# Altium schematic sheet LiPoBattery.SchDoc
size A4; SheetNumber: 1; SheetTotal: 1
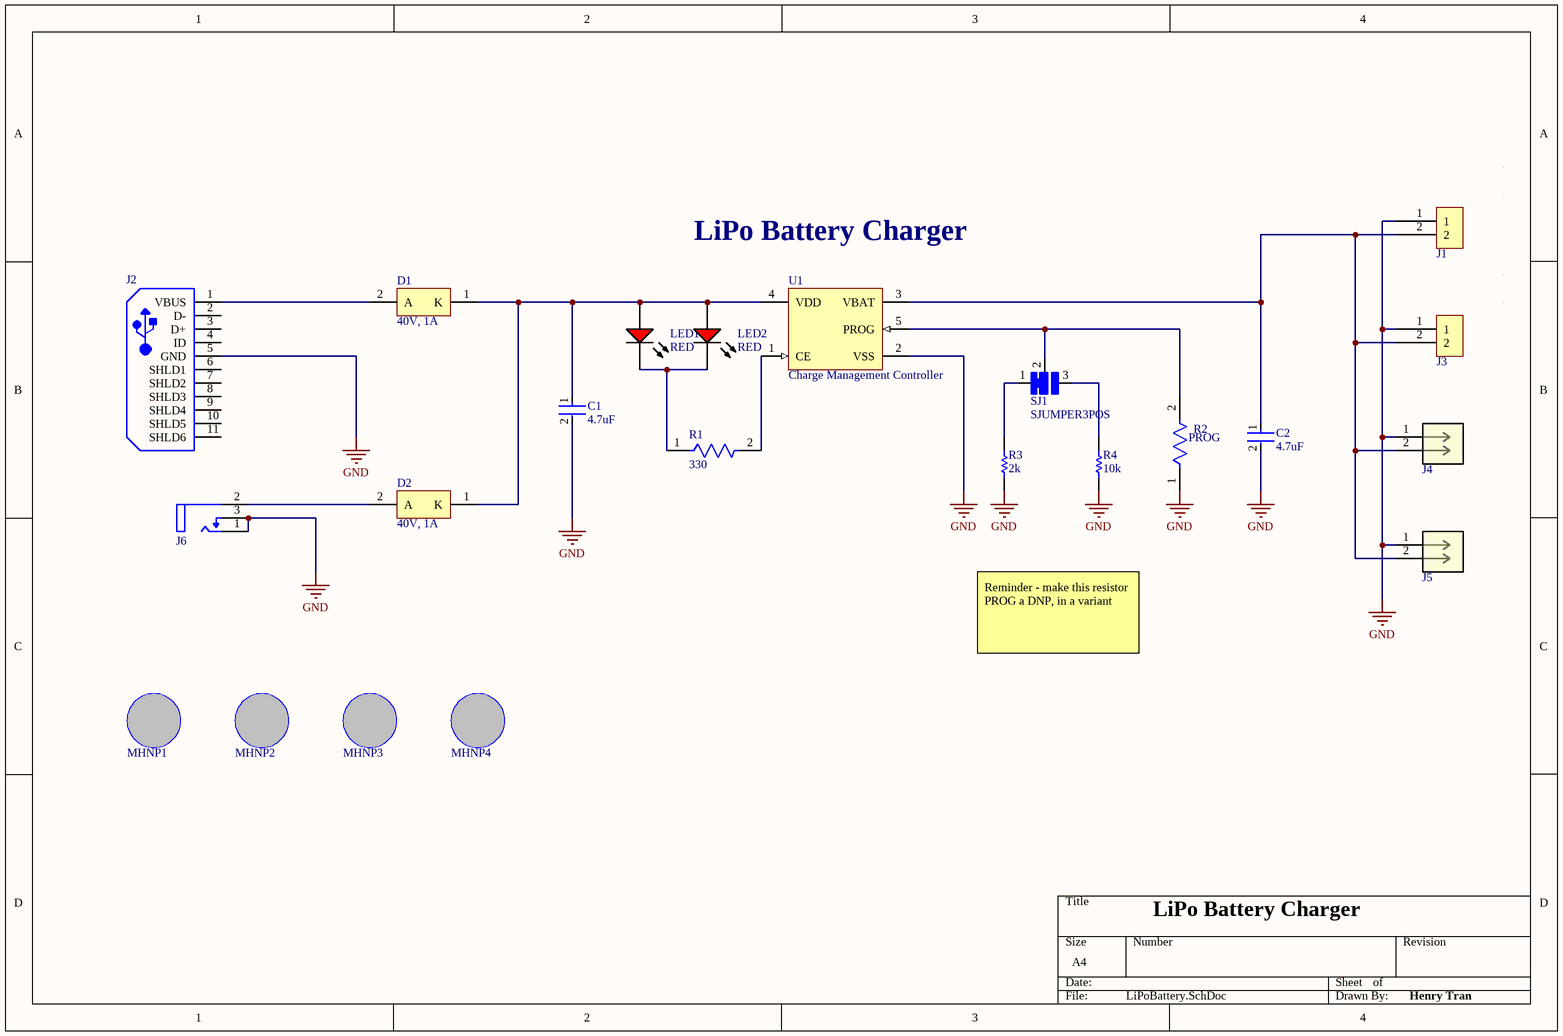
[diagram p0: LiPoBattery.SchDoc]

## Parts
C1  4.7uF  [FP-CC0805-0_85-MFG]
C2  4.7uF  [FP-CC0805-0_85-MFG]
D1  40V, 1A  [ONSC-SMA-2-403D-02_V]
D2  40V, 1A  [ONSC-SMA-2-403D-02_V]
J1  CONN HEADER R/A 2POS 5.08MM  [1-179276-2]  (value not drawn)
J2  105017-0001  [USB-MICRO-B_V]  (value not drawn)
J3  CONN HEADER R/A 2POS 5.08MM  [1-179276-2]  (value not drawn)
J4  2 POS VERT HEADER  0.100"  [2Pins_AMP]  (value not drawn)
J5  2 POS VERT HEADER  0.100"  [2Pins_AMP]  (value not drawn)
J6  CONN PWR JACK 2.1X5.5MM SOLDER  [FP-RASM722PTR13X-MFG]  (value not drawn)
LED1  RED  [VISH-TLMS1000_V]
LED2  RED  [VISH-TLMS1000_V]
MHNP1  Mounting Hole Non-Plated 3.2mm  [MTHNP3P2MM]  (value not drawn)
MHNP2  Mounting Hole Non-Plated 3.2mm  [MTHNP3P2MM]  (value not drawn)
MHNP3  Mounting Hole Non-Plated 3.2mm  [MTHNP3P2MM]  (value not drawn)
MHNP4  Mounting Hole Non-Plated 3.2mm  [MTHNP3P2MM]  (value not drawn)
R1  330  [FP-CRCW0805-e3-MFG]
R2  PROG  [FP-MRS25-MFG]
R3  2k  [RESC2013X70X40ML20T20]
R4  10k  [RESC2013X70X40ML20T20]
SJ1  SJUMPER3POS  [SJUMPER3POS-Footprint-1]
U1  Charge Management Controller  [SOT-23-OT5_M]

## Nets
GND: C1.2 C2.2 J1.1 J2.5(GND) J3.1 J4.1 J5.1 J6.1(TIP_TERMINAL(CENTER_PIN)) J6.3(SHUNT_TERMINAL) R2.1 R3.1 R4.1 U1.2(VSS)
NetC1_1: C1.1 D1.1(K) D2.1(K) LED1.1(A) LED2.1(A) U1.4(VDD)
NetC2_1: C2.1 J1.2 J3.2 J4.2 J5.2 U1.3(VBAT)
NetD1_2: D1.2(A) J2.1(VBUS)
NetD2_2: D2.2(A) J6.2(SLEEVE_TERMINAL)
NetLED1_2: LED1.2(K) LED2.2(K) R1.1
NetR1_2: R1.2 U1.1(CE)
NetR2_2: R2.2 SJ1.2 U1.5(PROG)
NetR3_2: R3.2 SJ1.1
NetR4_2: R4.2 SJ1.3

Not connected (* = marked no-connect by the designer): J2 2(D-) 3(D+) 4(ID) 6(SHLD1) 7(SHLD2) 8(SHLD3) 9(SHLD4) 10(SHLD5) 11(SHLD6)

## Notes on the sheet
- LiPo Battery Charger
- Reminder - make this resistor PROG a DNP, in a variant
- Henry Tran

## Library data of the parts
C1 C2 = CMP-03422-001352-1: CAP CER 4.7UF 6.3V X5R 0805; Manufacturer: Yageo; Manufacturer Part Number: CC0805KRX5R5BB475; Tolerance: 0.1; Material: Ceramic; Package: CC0805-0.85; Automotive: No; Capacitance: 4.7 uF; Lead Free: Yes; Footprint Url: http://www.yageo.com/exep/pages/download/literatures/UPY-C_GEN_24.pdf; Device Class L3: Ceramic Capacitors; Temperature Range High: +85°C; Height: 0.95mm; Category: Cap; Device Class L2: Capacitors; Digikey Description: CAP CER 4.7UF 6.3V X5R 0805; Device Class L1: Passive Components; ComponentLink2Description: Datasheet; Mouser Description: Multilayer Ceramic Capacitors MLCC - SMD/SMT 4.7uF 6.3V X5R 10%; Ipc Land Pattern Name: CAPC200125X85; Temperature Characteristic: X5R; ComponentLink2URL: http://www.yageo.com/documents/recent/UPY-GPHC_Y5V_6.3V-to-50V_8.pdf; RoHS: TRUE; Octopart: https://octopart.com/cc0805krx5r5bb475-yageo-12885121; Temperature: -30°C to +85°C; Voltage Rating: 6.3 V; Value: 4.7 uF; Temperature Range Low: -30°C
D1 D2 = CMP-1055-00320-1: Schottky Power Rectifier, 2-Pin SMA, Pb-Free, Tape and Reel; PartNumber: MBRA140T3G; Manufacturer: On Semiconductor; Configuration: Single; IFSM Max (A): 30; PackageReference: SMA-2-403D-02; PackageDescription: 2-Pin Small Molded Package, J-Bend Lead, Body 2.605 x 4.315 mm; RoHS: TRUE; ComponentLink1Description: Manufacturer URL; Packing: Tape and Reel; ComponentLink3URL: http://www.onsemi.com/pub_link/Collateral/403D-02.PDF; ComponentLink2Description: Datasheet; ComponentLink2URL: http://www.onsemi.cn/pub_link/Collateral/MBRA140T3-D.PDF; DatasheetVersion: Rev. 10; ComponentLink1URL: http://www.onsemi.com/; ComponentLink3Description: Package Specification; Mounting Technology: Surface Mount; PackageVersion: Rev. G, 07/2012
J1 J3 = 1-179276-2: Connector Header Through Hole, Right Angle 2 position 0.200" (5.08mm); Manufacturer: TE Connectivity AMP Connectors; Supplier 1: Digikey; MAnufacturer Part Number: 1-179276-2; ComponentLink1Description: Product URL; ComponentLink1URL: https://www.te.com/en/product-1-179276-2.html; Supplier Part Number 1: A29545-ND
J2 = CMP-2000-05827-1: Micro-USB B Receptacle, Right Angle, Bottom Mount, Surface Mount, with Solder Tabs, -30 to 85 degC, 5-Pin USB, RoHS, Tape and Reel; Manufacturer: Molex; Featured Product: Micro-USBConnectorsUSBConnectors; Other Names: WM1399DKR; Package Version: Rev. F, 12/2012; Number of Contacts: 5; Connector Type: USB-microB; Catalog Drawings: 1050170001; 3D Model: 105017-0001.stp; Mating Products: WM17145-ND-CABLEMICROUSBBTOSTDA1.0MWM17147-ND-CABLEMICROUSBBTOSTDA2.0MWM17146-ND-CABLEMICROUSBBTOSTDA1.5M; PCN Assembly/Origin: ResinSupplier21/Oct/2015; Voltage - Max: 30V; Online Catalog: Molex-MicroUSB; Manufacturer URL: http://www.molex.com/; Package Description: 5-Leads USB, Micro B, Body 7.5 x 5 mm, Pitch 0.65 mm; Datasheet URL: http://www.molex.com/elqNow/elqRedir.htm?ref=http://www.molex.com/webdocs/datasheets/pdf/en-us/1050170001_IO_CONNECTORS.pdf; Ingress Protection: -; Datasheet Version: 03/2016; Mounting Type: BoardCutout,SurfaceMount,RightAngle; Circuits: 5; Standard Package: 1; Package Reference: MICRO-B; Package URL: http://www.molex.com/pdm_docs/sd/1050170001_sd.pdf; Category: Connectors,Interconnects; Series: -; RoHS Information: 1050170001CertofCompliance; Features: Shielded,SolderRetention; Family: USB,DVI,HDMIConnectors; Specifications: -; Gender: Receptacle; Packaging: Digi-Reel®; Mounting Technology: SurfaceMount
J4 J5 = 67997-402HLF: Connector Header Through Hole 2 position; Mfr_Name: Amphenol ICC; RefDes: RefDes; Type: Type; Supplier 1: Arrow Electronics; Supplier Part Number 1: 67997-402HLF
J6 = CMP-47995-000002-1: Shielding: Unshielded; Gender: Male; Current Rating: 5A; Termination: Solder; Contact Material: Copper Alloy; Package Quantity: 120; Case/Package: SMD/SMT; Contact Plating: Tin; Connector Type: Jack; Housing Material: Thermoplastic; Mount: Surface Mount; Housing Color: Black; Color: Black
LED1 LED2 = CMP-2000-07254-1: Low Current LED, 40 mW, 1.8 V, -40 to 100 degC, 2-Pin SMD (0603), RoHS, Tape and Reel; Manufacturer: Vishay; Lens Shape: Rectangular; Automotive Qualification Standard: AEC-Q100; Wavelength Typ: 636nm; SVHC: ToBeAdvised; Bulb Size: 1.6mmx0.8mm; Forward Voltage: 1.8V; Luminous Intensity: 4mcd; Forward Current If: 2mA; Viewing Angle: 80°; Datasheet Version: Rev. 1.7, 02/2011; Datasheet URL: https://datasheet.ciiva.com/5798/1698881-5798337.pdf; LED Mounting: SMD; Packaging: CutTape; Package Reference: TLMS1000; Manufacturer URL: http://www.vishay.com/; Mounting Technology: SurfaceMount; Product Range: -; LED Colour: Red; Package Description: 2-Pin Surface Mount Device, Body 1.6 x 0.8 mm; MSL: MSL2-1year
MHNP1-MHNP4 = MTHNP3P2MM: Mounting Hole Non-Plated 3.2mm drill hole
R1 = CMP-2001-03823-2: RES Thick Film, 330Ω, 1%, 0.125W, 100ppm/°C, 0805; Voltage Rating (DC): 150V; Resistance: 330R; Max Power Dissipation: 125mW; Mount: Surface Mount; Packaging: Tape and Reel; Min Operating Temperature: -55°C; Military Standard: Not; Case Code (Metric): 2012; Height: 0.02inch; Voltage Rating: 150V; Case/Package: 0805; Max Operating Temperature: 155°C; Width: 0.049inch; Case Code (Imperial): 0805; Termination: SMD/SMT; Lead Free: Lead Free; Contact Plating: Tin; Package Quantity: 10; Composition: Thick Film; Length: 2mm; Features: Automotive AEC-Q200; Depth: 1.25mm; Weight: 0.000194oz; Tolerance: 1%; Power Rating: 125mW; Number of Terminations: 2; Temperature Coefficient: 100ppm/°C
R2 = CMP-00030-42757237-1: MRS25000C1000FRP00 Resistor, 100 Ohm, ± 1%, 600 mW, Axial Leaded, Metal Film (Thin Film), Professional; Max Power Dissipation: 600mW; Resistance: 100Ω; Voltage Rating: 350V; Temperature Coefficient: 50ppm/°C; Lead Diameter: 600µm; RoHS: Compliant; Radiation Hardening: No; Schedule B: 8533210090, 8533210090; Length: 6.5mm; Packaging: Tape & Reel (TR); Number of Terminations: 2; Mount: Through Hole; Width: 2.5mm; Tolerance: 1%; Military Standard: Not; Voltage Rating (DC): 350V; Contact Plating: Tin; Number of Pins: 2; Max Operating Temperature: 155°C; NexarPartId: 42757237; Diameter: 2.5mm; Composition: Metal Film, Thin Film; REACH SVHC: Unknown; Power Rating: 600mW; Lead Free: Lead Free; Termination: Axial; Case/Package: Axial; Min Operating Temperature: -55°C
R3 = CMP-2001-00370-1: Part Number: ERJ-6GEYJ202V; Manufacturer: Panasonic
R4 = CMP-2001-04376-1: Manufacturer: Panasonic; Part Number: ERJ-6ENF1002V
SJ1 = CMP-00030-00001-3: Solder jumer 3 pads and pins; Pins: 3
U1 = CMP-0133-00139-1: Simple, Miniature Single-Cell, Fully Integrated Li-Ion/Li-Polymer Charge Management Controller, 4.2V, 5-Pin SOT-23, Industrial Temperature, Tape and Reel; Code_IPC: SOT23-5; PackageDescription: 5-Lead Plastic Small Outline Transistor (OT) [SOT-23]; PackageVersion: revBB, Aug-2009; DatasheetVersion: revB, Sep-2007; PackageReference: SOT-23-OT5